# Altium project Project_Robot_SSL.PrjPcb
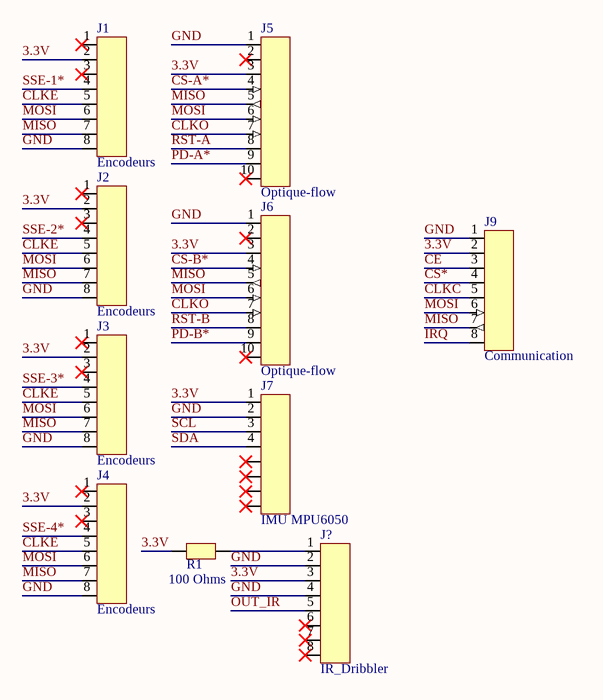
[diagram p0: Sheet1.SchDoc]
1 sheet, 10 parts. Net scope: global (net labels, ports and power ports of the same name join across sheets).

## Sheet Sheet1.SchDoc: Sheet-Sensors-Comm
size A4; Author: HALLO Matthieu; CompanyName: YNOV

### Parts
J1  Encodeurs  [Encodeur/IMU]
J2  Encodeurs  [Encodeur/IMU]
J3  Encodeurs  [Encodeur/IMU]
J4  Encodeurs  [Encodeur/IMU]
J5  Optique-flow  [IR_optique]
J6  Optique-flow  [IR_optique]
J7  IMU MPU6050  [Encodeur/IMU]
J9  Communication  [Comm nRF24L01]
J?  IR_Dribbler  [Encodeur/IMU]
R1  Resistance  [empreinte 1206]  (value not drawn)

### Nets
3.3V: J1.2 J2.2 J3.2 J4.2 J5.3 J6.3 J7.1 J9.2 J?.3 R1.1
CE: J9.3
CLKC: J9.5
CLKE: J1.5 J2.5 J3.5 J4.5
CLKO: J5.7 J6.7
CS*: J9.4
CS-A*: J5.4
CS-B*: J6.4
GND: J1.8 J2.8 J3.8 J4.8 J5.1 J6.1 J7.2 J9.1 J?.2 J?.4
IRQ: J9.8
MISO: J1.7 J2.7 J3.7 J4.7 J5.5 J6.5 J9.7
MOSI: J1.6 J2.6 J3.6 J4.6 J5.6 J6.6 J9.6
OUT_IR: J?.5
PD-A*: J5.9
PD-B*: J6.9
RST-A: J5.8
RST-B: J6.8
SCL: J7.3
SDA: J7.4
SSE-1*: J1.4
SSE-2*: J2.4
SSE-3*: J3.4
SSE-4*: J4.4
NetJ?_1: J?.1 R1.2

Not connected (* = marked no-connect by the designer): J1 1* 3*; J2 1* 3*; J3 1* 3*; J4 1* 3*; J5 2* 10*; J6 2* 10*; J7 5* 6* 7* 8*; J? 6* 7* 8*

### Library data of the parts
J1-J4 J? = Encodeurs: AS5048A
J5 J6 = Optique-flow: ADNS3080
J7 = IMU MPU6050: MPU6050 IMU
J9 = Communication: Communication radio
R1 = Resistance: 100 Ohms: 100 Ohms